# Altium schematic sheet CURRENT_SENSE.SchDoc
size A4; SheetNumber: 3; SheetTotal: 3
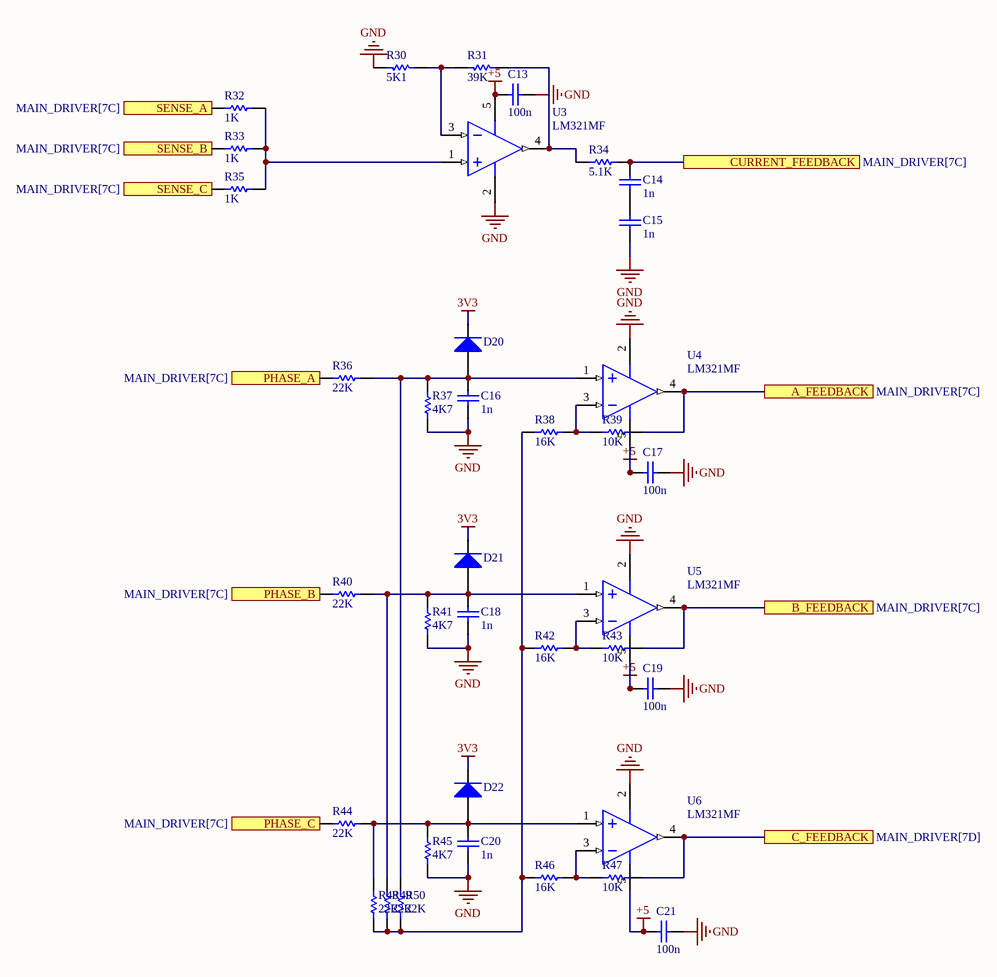
[diagram p0: CURRENT_SENSE.SchDoc]

## Parts
C13  value 100n  [CAP FILM 0603_1608]  (hidden comment: Capacitor)
C14  value 1n  [CAP FILM 0603_1608]  (hidden comment: Capacitor)
C15  value 1n  [CAP FILM 0603_1608]  (hidden comment: Capacitor)
C16  value 1n  [CAP FILM 0603_1608]  (hidden comment: Capacitor)
C17  value 100n  [CAP FILM 0603_1608]  (hidden comment: Capacitor)
C18  value 1n  [CAP FILM 0603_1608]  (hidden comment: Capacitor)
C19  value 100n  [CAP FILM 0603_1608]  (hidden comment: Capacitor)
C20  value 1n  [CAP FILM 0603_1608]  (hidden comment: Capacitor)
C21  value 100n  [CAP FILM 0603_1608]  (hidden comment: Capacitor)
D20  1N4148W  [SODFL375X135-2N]  (value not drawn)
D21  1N4148W  [SODFL375X135-2N]  (value not drawn)
D22  1N4148W  [SODFL375X135-2N]  (value not drawn)
R30  value 5K1  [RES 0603_1608 RF]  (hidden comment: Resistor)
R31  value 39K  [RES 0603_1608 RF]  (hidden comment: Resistor)
R32  value 1K  [RES 0603_1608 RF]  (hidden comment: Resistor)
R33  value 1K  [RES 0603_1608 RF]  (hidden comment: Resistor)
R34  value 5.1K  [RES 0603_1608 RF]  (hidden comment: Resistor)
R35  value 1K  [RES 0603_1608 RF]  (hidden comment: Resistor)
R36  value 22K  [RES 0603_1608 RF]  (hidden comment: Resistor)
R37  value 4K7  [RES 0603_1608 RF]  (hidden comment: Resistor)
R38  value 16K  [RES 0603_1608 RF]  (hidden comment: Resistor)
R39  value 10K  [RES 0603_1608 RF]  (hidden comment: Resistor)
R40  value 22K  [RES 0603_1608 RF]  (hidden comment: Resistor)
R41  value 4K7  [RES 0603_1608 RF]  (hidden comment: Resistor)
R42  value 16K  [RES 0603_1608 RF]  (hidden comment: Resistor)
R43  value 10K  [RES 0603_1608 RF]  (hidden comment: Resistor)
R44  value 22K  [RES 0603_1608 RF]  (hidden comment: Resistor)
R45  value 4K7  [RES 0603_1608 RF]  (hidden comment: Resistor)
R46  value 16K  [RES 0603_1608 RF]  (hidden comment: Resistor)
R47  value 10K  [RES 0603_1608 RF]  (hidden comment: Resistor)
R48  value 22K  [RES 0603_1608 RF]  (hidden comment: Resistor)
R49  value 22K  [RES 0603_1608 RF]  (hidden comment: Resistor)
R50  value 22K  [RES 0603_1608 RF]  (hidden comment: Resistor)
U3  LM321MF  [DBV0005A_L]
U4  LM321MF  [DBV0005A_L]
U5  LM321MF  [DBV0005A_L]
U6  LM321MF  [DBV0005A_L]

## Ports
A_FEEDBACK (see MAIN_DRIVER[7C]), B_FEEDBACK (see MAIN_DRIVER[7C]), C_FEEDBACK (see MAIN_DRIVER[7D]), CURRENT_FEEDBACK (see MAIN_DRIVER[7C]), PHASE_A (see MAIN_DRIVER[7C]), PHASE_B (see MAIN_DRIVER[7C]), PHASE_C (see MAIN_DRIVER[7C]), SENSE_A (see MAIN_DRIVER[7C]), SENSE_B (see MAIN_DRIVER[7C]), SENSE_C (see MAIN_DRIVER[7C])

## Nets
3V3: D20.2(K) D21.2(K) D22.2(K)
+5: C13.1 C17.1 C19.1 C21.1 U3.5(V+) U4.5(V+) U5.5(V+) U6.5(V+)
GND: C13.2 C15.1 C16.1 C17.2 C18.1 C19.2 C20.1 C21.2 R30.2 R37.1 R41.1 R45.1 U3.2(V-) U4.2(V-) U5.2(V-) U6.2(V-)
A_FEEDBACK: R39.2 U4.4(OUT) ; port A_FEEDBACK
B_FEEDBACK: R43.2 U5.4(OUT) ; port B_FEEDBACK
C_FEEDBACK: R47.2 U6.4(OUT) ; port C_FEEDBACK
CURRENT_FEEDBACK: C14.2 R34.2 ; port CURRENT_FEEDBACK
PHASE_A: R36.1 ; port PHASE_A
PHASE_B: R40.1 ; port PHASE_B
PHASE_C: R44.1 ; port PHASE_C
SENSE_A: R32.1 ; port SENSE_A
SENSE_B: R33.1 ; port SENSE_B
SENSE_C: R35.1 ; port SENSE_C
NetC14_1: C14.1 C15.2
NetC16_2: C16.2 D20.1(A) R36.2 R37.2 R50.2 U4.1(IN+)
NetC18_2: C18.2 D21.1(A) R40.2 R41.2 R49.2 U5.1(IN+)
NetC20_2: C20.2 D22.1(A) R44.2 R45.2 R48.2 U6.1(IN+)
NetR30_1: R30.1 R31.1 U3.3(IN-)
NetR31_2: R31.2 R34.1 U3.4(OUT)
NetR32_2: R32.2 R33.2 R35.2 U3.1(IN+)
NetR38_1: R38.1 R42.1 R46.1 R48.1 R49.1 R50.1
NetR38_2: R38.2 R39.1 U4.3(IN-)
NetR42_2: R42.2 R43.1 U5.3(IN-)
NetR46_2: R46.2 R47.1 U6.3(IN-)

## Library data of the parts
C13-C21 = Capacitor: SimulationGenericComponent: True
D20-D22 = Diode: AF: 1; BV: 0; BV_MAX: 1e99; EG: 1.11; FC: 0.5; IBV: 0.001; ISR: 1e-14; MJSW: 0.33; NTUN: 30; TNOM: 27; XTI: 3; SimulationGenericComponent: True; CJO: 0; CJP: 0; CTA: 0; CTP: 0; FCS: 0.5; FV_MAX: 1e99; IKF: 0; IKR: 0; JSW: 0; JTUN: 0; JTUNSW: 0; KEG: 1; KF: 0; LEVEL: 1; N: 1; NBV: 1; NR: 1; NS: 1; PHP: 1; RS: 0; TCV: 0; TLEV: 0; TLEVC: 0; TM1: 0; TM2: 0; TPB: 0; TPHP: 0; TRS: 0; TRS2: 0; TT: 0; TTT1: 0; TTT2: 0; VJ: 1; XTITUN: 3; IS: 1e-14
R30-R50 = Resistor: TC1: 0; SimulationGenericComponent: True; TC2: 0
U3-U6 = CMP-0055-01325-3: Low Power Single Op Amp, 5-pin SOT-23; Manufacturer: Texas Instruments; PackageTopMarking: A63A*XTT; CompType: Amplifiers; PowerWise: N; ComponentLink1URL: http://www.ti.com/general/docs/lit/getliterature.tsp?genericPartNumber=LM321&fileType=pdf; PinCount: 5; RoHS: N; ComponentLink1Description: Datasheet URL; Package Reference: DBV0005A; PackageDescription: Molded SOT-23, .115 x .063 x .040 in Body, 5 Lead, .0375 in Pitch